# Altium schematic sheet Ethernet.SchDoc
size A4
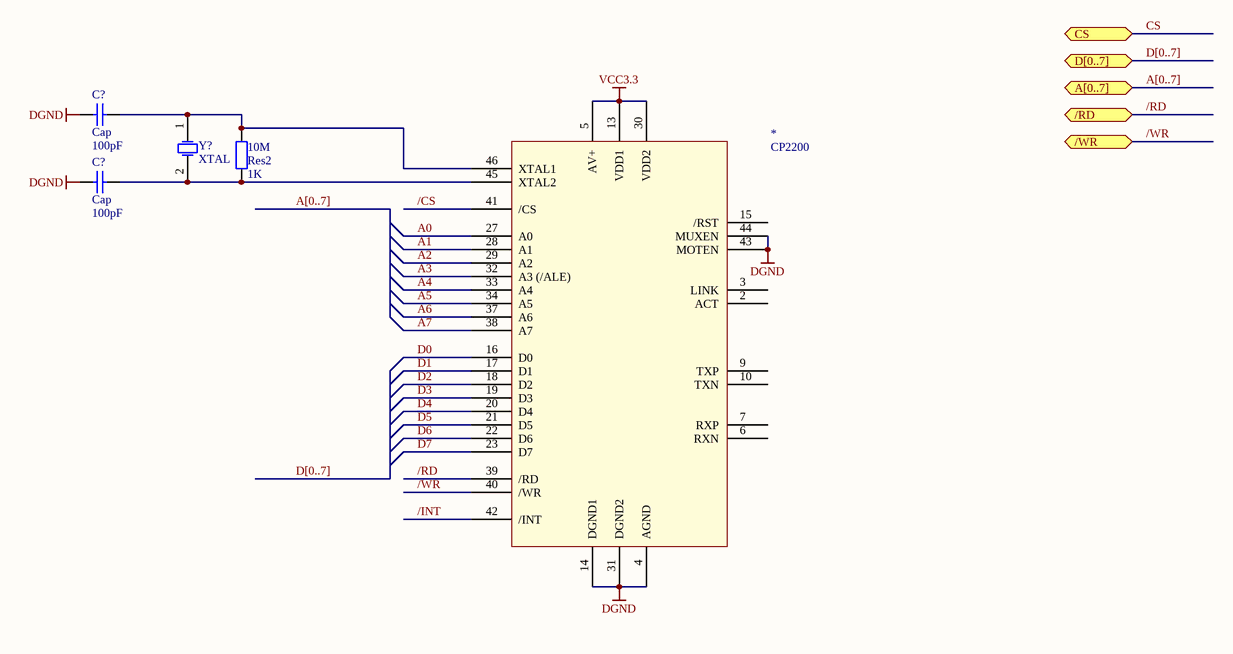
[diagram p0: Ethernet.SchDoc]

## Parts
(Parts that share a designator on the sheet are numbered #1, #2 ... from top to bottom, then left to right.)
10M  Res2  value 1K  [AXIAL-0.4]
*  CP2200
C?#1  Cap  value 100pF  [RAD-0.3]
C?#2  Cap  value 100pF  [RAD-0.3]
Y?  XTAL  [R38]

## Ports
/RD, /WR, A[0..7], CS, D[0..7]

## Nets
DGND: *.4(AGND) *.14(DGND1) *.31(DGND2) *.43(MOTEN) *.44(MUXEN) C?#1.1 C?#2.1
VCC3.3: *.5(AV+) *.13(VDD1) *.30(VDD2)
/CS: *.41(/CS)
/INT: *.42(/INT)
/RD: *.39(/RD) ; port /RD
/WR: *.40(/WR) ; port /WR
A0: *.27(A0)
A1: *.28(A1)
A2: *.29(A2)
A3: *.32(A3_(/ALE))
A4: *.33(A4)
A5: *.34(A5)
A6: *.37(A6)
A7: *.38(A7)
CS: port CS
D0: *.16(D0)
D1: *.17(D1)
D2: *.18(D2)
D3: *.19(D3)
D4: *.20(D4)
D5: *.21(D5)
D6: *.22(D6)
D7: *.23(D7)
Net10M_1: 10M.1 *.45(XTAL2) C?#2.2 Y?.2(OSC2)
Net10M_2: 10M.2 *.46(XTAL1) C?#1.2 Y?.1(OSC1)

Not connected (* = marked no-connect by the designer): * 2(ACT) 3(LINK) 6(RXN) 7(RXP) 9(TXP) 10(TXN) 15(/RST)

## Buses and harness runs
bus A[0..7]
bus A[0..7] = port A[0..7]
bus D[0..7]
bus D[0..7] = port D[0..7]

## Library data of the parts
10M = Res2: Resistor; Published: 8-Jun-2000; LatestRevisionDate: 17-Jul-2002; LatestRevisionNote: Re-released for DXP Platform.; PackageReference: AXIAL-0.4; Publisher: Altium Limited
C?#1 C?#2 = Cap: Capacitor; Published: 8-Jun-2000; LatestRevisionDate: 17-Jul-2002; LatestRevisionNote: Re-released for DXP Platform.; PackageReference: RAD-0.3; Publisher: Altium Limited
Y? = XTAL: Crystal Oscillator; Published: 8-Jun-2000; LatestRevisionDate: 17-Jul-2002; LatestRevisionNote: Re-released for DXP Platform.; PackageReference: R38; Publisher: Altium Limited